# Altium schematic sheet Power_CAN.SchDoc: Power and CAN
size A; DrawnBy: Andrew Pobrica; DocumentNumber: 4; SheetNumber: 4; SheetTotal: 7
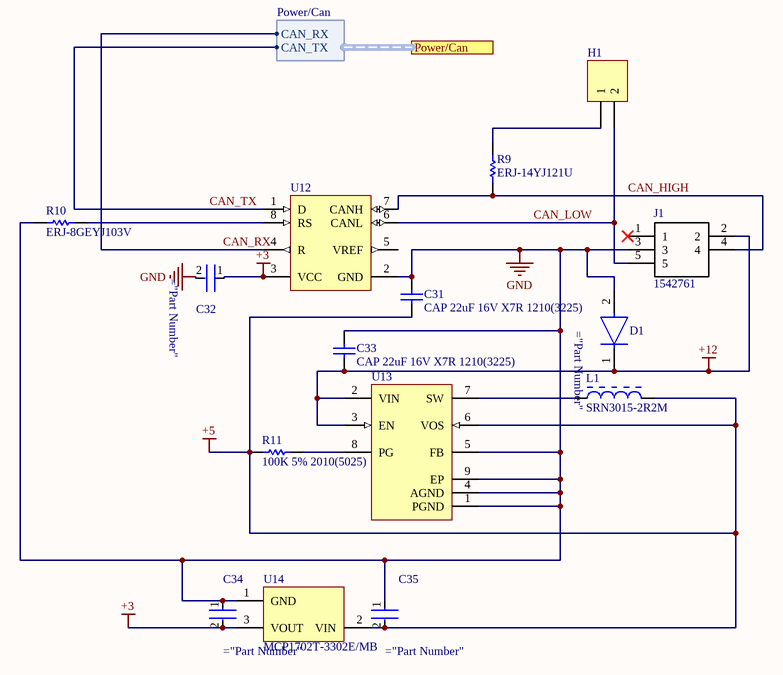
[diagram p0: Power_CAN.SchDoc]

## Parts
C31  CAP 22uF 16V X7R 1210(3225)  [CAPC1210(3225)280_L]
C32  C0603C104K5RACTU  [Kemet_C0805_IPC_A]  (value not drawn)
C33  CAP 22uF 16V X7R 1210(3225)  [CAPC1210(3225)280_L]
C34  C0805C105K4RACTU  [Kemet_C0805_IPC_A]  (value not drawn)
C35  C0805C105K4RACTU  [Kemet_C0805_IPC_A]  (value not drawn)
D1  S1J-13-F  [Diodes_SMA_0]  (value not drawn)
H1  Header 0  [HDR1X2]  (value not drawn)
J1  1542761  [1542761]
L1  SRN3015-2R2M  [BOUR-SRN3015-2_V]
R9  ERJ-14YJ121U  [RESC3225X70X50ML20T20]
R10  ERJ-8GEYJ103V  [RESC3216X70X50NL05T20]
R11  100K 5% 2010(5025)  [RESC2010(5025)_L]
U12  SN65HVD230D  [D0008A_M]  (value not drawn)
U13  TPS62173DSGR  [DSG8-1600X900TP]  (value not drawn)
U14  MCP1702T-3302E/MB  [SOT-89-MB3_N]

## Ports
Power/Can (harness Power/Can)

## Harnesses
Power/Can: CAN_RX, CAN_TX

## Nets
+3: C32.1 C34.2 U12.3(VCC) U14.3(VOUT)
+5: C31.1 C35.2 L1.2 R11.1 U13.6(VOS) U14.2(VIN)
+12: C33.1 D1.1(C) J1.2 U13.2(VIN) U13.3(EN)
GND: C31.2 C32.2 C33.2 C34.1 C35.1 D1.2(A) J1.3 R10.2 U12.2(GND) U13.1(PGND) U13.4(AGND) U13.5(FB) U13.9(EP) U14.1(GND)
CAN_HIGH: J1.4 R9.1 U12.7(CANH)
CAN_LOW: H1.2 J1.5 U12.6(CANL)
CAN_RX: U12.4(R) ; port Power/Can.CAN_RX
CAN_TX: U12.1(D) ; port Power/Can.CAN_TX
NetH1_1: H1.1 R9.2
NetL1_1: L1.1 U13.7(SW)
NetR10_1: R10.1 U12.8(RS)
NetR11_2: R11.2 U13.8(PG)

Not connected (* = marked no-connect by the designer): J1 1*; U12 5(VREF)

## Library data of the parts
C31 C33 = CMP-1038-02277-1: CAP 22uF 16V ±10% 1210 (3225 Metric) Thickness 2.8mm SMD; Case-Metric: 3225; Case-EIA: 1210; Tolerance: Â±10%; Rated Voltage: 16 V; Technology: SMT; Value: 22uF; Max Thickness: 2.8 mm
H1 = Header 2: Header, 2-Pin; LatestRevisionDate: 17-Jul-2002; LatestRevisionNote: Re-released for DXP Platform.; Publisher: Altium Limited
J1 = 1542761: Connector; Manufacturer_Name: Phoenix Contact; Allied_Number: 70170366; Datasheet Link: https://media.digikey.com/PDF/Data%20Sheets/Phoenix%20Contact%20PDFs/1542761.pdf; Height: 18mm; Manufacturer_Part_Number: 1542761; Mouser Part Number: 651-1542761; Mouser Price/Stock: https://www.mouser.com/Search/Refine.aspx?Keyword=651-1542761; RS Part Number: 8025583; RS Price/Stock: http://uk.rs-online.com/web/p/products/8025583; Allied Price/Stock: https://www.alliedelec.com/phoenixcontact-1542761/70170366/
L1 = CMP-0007-00003-1: Semi-shielded Power Inductor, 2.2 uH, +/- 20%, 1.8 A, -40 to 125 degC, 3 x 3 x 1.5 mm SMD, RoHS and Halogen Free, Tape and Reel; Manufacturer: Bourns; Isat: 1.65 A; Rated current: 1.8 A; Inductance: 2.2 uH; Inductance tolerance: +/- 20%; DCR Max: 0.072 Ohm; SRF Min: 90 MHz; Resistance to Solder Heat: +260 degC for 10 sec.; Operating Temperature: -40 to 125 degC; PartNumber: SRN3015-2R2M; Packing: Tape and Reel; ComponentLink3Description: Package Specification; ComponentLink2Description: Datasheet; RoHS: TRUE; ComponentLink3URL: http://www.bourns.com/data/global/pdfs/SRN3015.pdf; PackageDescription: 2-Pin SMD, Body 3 x 3 mm, Height 1.5 mm; ComponentLink1URL: http://www.bourns.com/; ComponentLink1Description: Manufacturer URL; DatasheetVersion: Aug-11; Mounting Technology: Surface Mount; ComponentLink2URL: http://www.bourns.com/data/global/pdfs/SRN3015.pdf; PackageReference: SRN3015
R9 = CMP-2005-03490-1: Manufacturer: Panasonic; Part Number: ERJ-14YJ121U
R10 = CMP-2003-00545-1: Manufacturer: Panasonic; Part Number: ERJ-8GEYJ103V
R11 = CMP-1017-00122-1: 100K 0.75W 5% 2010 (5025 Metric)  SMD; Value: 100000.00 Ohm; Case-Metric: 5025; Case-EIA: 2010; Technology: SMT; Power: 0.75 W; Tolerance: 5 %
U12 = CMP-0315-00046-3: CAN Bus Transceiver, 3.3 V, -40 to 85 degC, 8-Pin SOIC (D), Green (RoHS & no Sb/Br), Tube; Supply Voltage Min: 3 V; Supply Voltage Max: 3.6 V; PartNumber: SN65HVD230D; ComponentLink2URL: http://www.ti.com/general/docs/lit/getliterature.tsp?genericGeneric Part Number=SN65HVD230&fileType=pdf; DatasheetVersion: SLOS346N; Generic Part Number: SN65HVD230; Packing: Tube; Temperature Min: -40 degC; Temperature Max: 85 degC; ComponentLink1Description: Manufacturer URL; Mounting Technology: Surface Mount; RoHS: TRUE; ComponentLink1URL: http://www.ti.com/; ComponentLink2Description: Datasheet; PackageDescription: 8-Pin Plastic Small Outline, Body 4.9 x 3.9 mm, Pitch 1.27 mm
U13 = CMP-0323-00320-3: Buck Step Down Regulator with 3 to 17 V Input and 5 V Output, -40 to 85 degC, 8-Pin WSON (DSG), Green (RoHS & no Sb/Br); Manufacturer: Texas Instruments; Switch Current Limit(Typ)(A): 1.05; Vin(Min)(V): 3; Regulated Outputs(#): 1; Rating: Catalog; Vout(Min)(V): 5; Duty Cycle(Max)(%): 100; SubFamily: Step-Down Regulator; Vin(Max)(V): 17; Iout(Max)(A): 0.5; Synchronous Rectification: TRUE; Iq(Typ)(mA): 0.017; ComponentLink1URL: http://www.ti.com/general/docs/lit/getliterature.tsp?genericPartNumber=TPS62173&fileType=pdf; Code_JEDEC: MO-229; PackageDescription: 8-Pin Plastic Small Outline No-Lead, 2 x 2 x 0.8 mm Body, 0.5 mm Pitch, Exposed Pad; PackageVersion: revB, Oct-2010; Mounting Technology: Surface Mount; PartNumber: TPS62173DSGR; PackageReference: DSG0008A; Topology: Buck; ComponentLink1Description: Datasheet; DatasheetVersion: SLVSAT8A; ComponentLink2Description: Package Specification; Eco-Plan: Green (RoHS & no Sb/Br); Vout(Max)(V): 5; ComponentLink2URL: http://www.ti.com/litv/pdf/mpds308a; ComponentLink3URL: Samples URL:http://www.ti.com/product/tps62173#samples; ComponentLink3Description: URL Link1; Preset Vout(V): 5
U14 = CMP-0136-00852-1: 250 mA Low Quiescent Current LDO Regulator, 3-Pin SOT-89, Extended Temperature, Tape and Reel; Code_IPC: SOT89; DatasheetVersion: revD, Jun-2009; PackageDescription: 3-Lead Plastic Small Outline Transistor Header (MB) [SOT-89]; PackageVersion: revBB, Aug-2009; PackageReference: SOT-89-MB3